# Altium schematic sheet Touch Slider.SchDoc
size A4; Revision: B.2
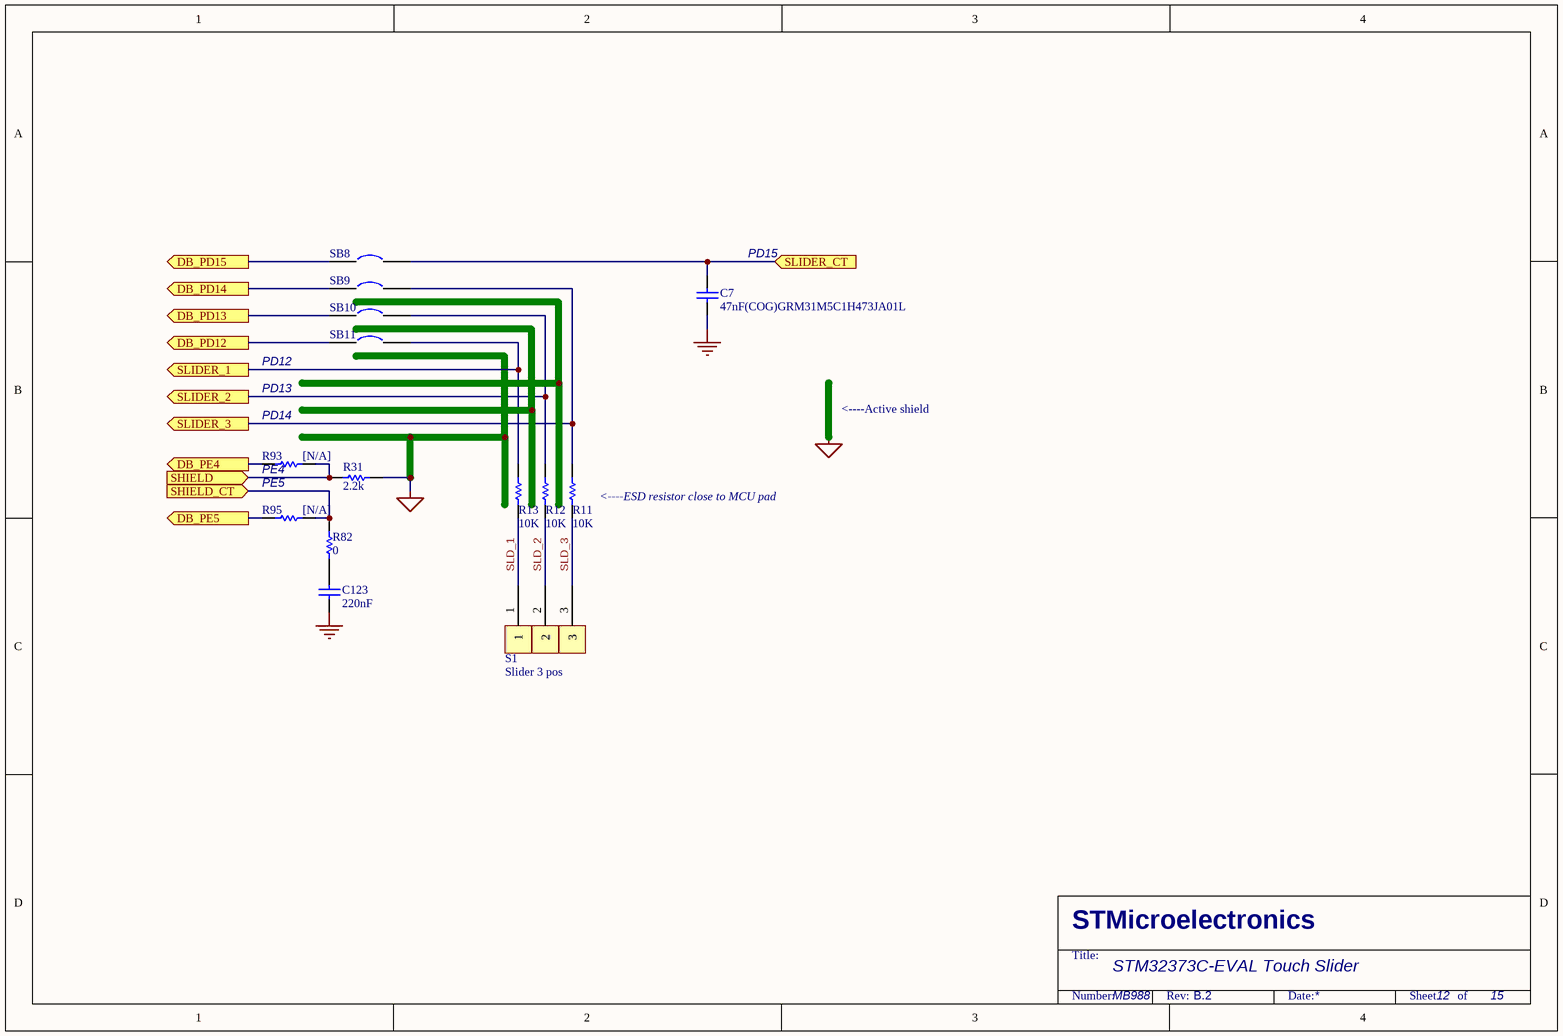
[diagram p0: Touch Slider.SchDoc]

## Parts
C7  47nF(COG)GRM31M5C1H473JA01L  [1206C]
C123  220nF  [0603C]
R11  10K  [0603R]
R12  10K  [0603R]
R13  10K  [0603R]
R31  2.2k  [0603R]
R82  0  [0603R]
R93  [N/A]  [0603R]
R95  [N/A]  [0603R]
S1  Slider 3 pos  [SLIDER3-2(50)]
SB8  (no value)  [JP2_SMD]
SB9  (no value)  [JP2_SMD]
SB10  (no value)  [JP2_SMD]
SB11  (no value)  [JP2_SMD]

## Ports
DB_PD12 (out), DB_PD13 (out), DB_PD14 (out), DB_PD15 (out), DB_PE4 (out), DB_PE5 (out), SHIELD (in), SHIELD_CT (in), SLIDER_1 (out), SLIDER_2 (out), SLIDER_3 (out), SLIDER_CT (in)

## Nets
GND: C7.1 C123.1
TS_SHIELD: R31.2
DB_PD12: SB11.1 ; port DB_PD12
DB_PD13: SB10.1 ; port DB_PD13
DB_PD14: SB9.1 ; port DB_PD14
DB_PD15: SB8.1 ; port DB_PD15
DB_PE4: R93.2 ; port DB_PE4
DB_PE5: R95.2 ; port DB_PE5
SHIELD: R31.1 R93.1 ; port SHIELD
SHIELD_CT: R82.1 R95.1 ; port SHIELD_CT
SLD_1: R13.2 S1.1
SLD_2: R12.2 S1.2
SLD_3: R11.2 S1.3
SLIDER_1: R13.1 SB11.2 ; port SLIDER_1
SLIDER_2: R12.1 SB10.2 ; port SLIDER_2
SLIDER_3: R11.1 SB9.2 ; port SLIDER_3
SLIDER_CT: C7.2 SB8.2 ; port SLIDER_CT
NetC123_2: C123.2 R82.2

## Notes on the sheet
- (near C7) PD15
- PD12
- PD13
- (near R93) PD14
- <----Active shield
- (near R93) PE4
- (near R93) PE5
- (near R11) <----ESD resistor close to MCU pad
- STM32373C-EVAL Touch Slider
- MB988
- 12
- 15
- STMicroelectronics
- Title:
- Number:
- Rev:
- Date:
- Sheet       of

## Library data of the parts
C7 C123 = CAP: Capacitor; Value: 100pF; Published: 8-Jun-2000; Revision: July-2002: Re-released for DXP Platform.; Publisher: Altium Limited
R11-R13 = res1: Resistor; Value: 1K; Published: 8-Jun-2000; Revision: July-2002: Re-released for DXP Platform.; Publisher: Altium Limited
R31 R82 R93 R95 = Res1: Resistor; Value: 1K; Published: 8-Jun-2000; Revision: July-2002: Re-released for DXP Platform.; Publisher: Altium Limited
S1 = Slider 3 pos: plan de cuivre recouvert de vernis + Couche Plastic; Description: plan de cuivre recouvert de vernis
SB8-SB11 = Circuit Breaker: Published: 24-Mar-1999; Revision: July-2002: Re-released for DXP Platform.; Publisher: Altium Limited